# EAGLE design power_amp (EAGLE 6.5.0)
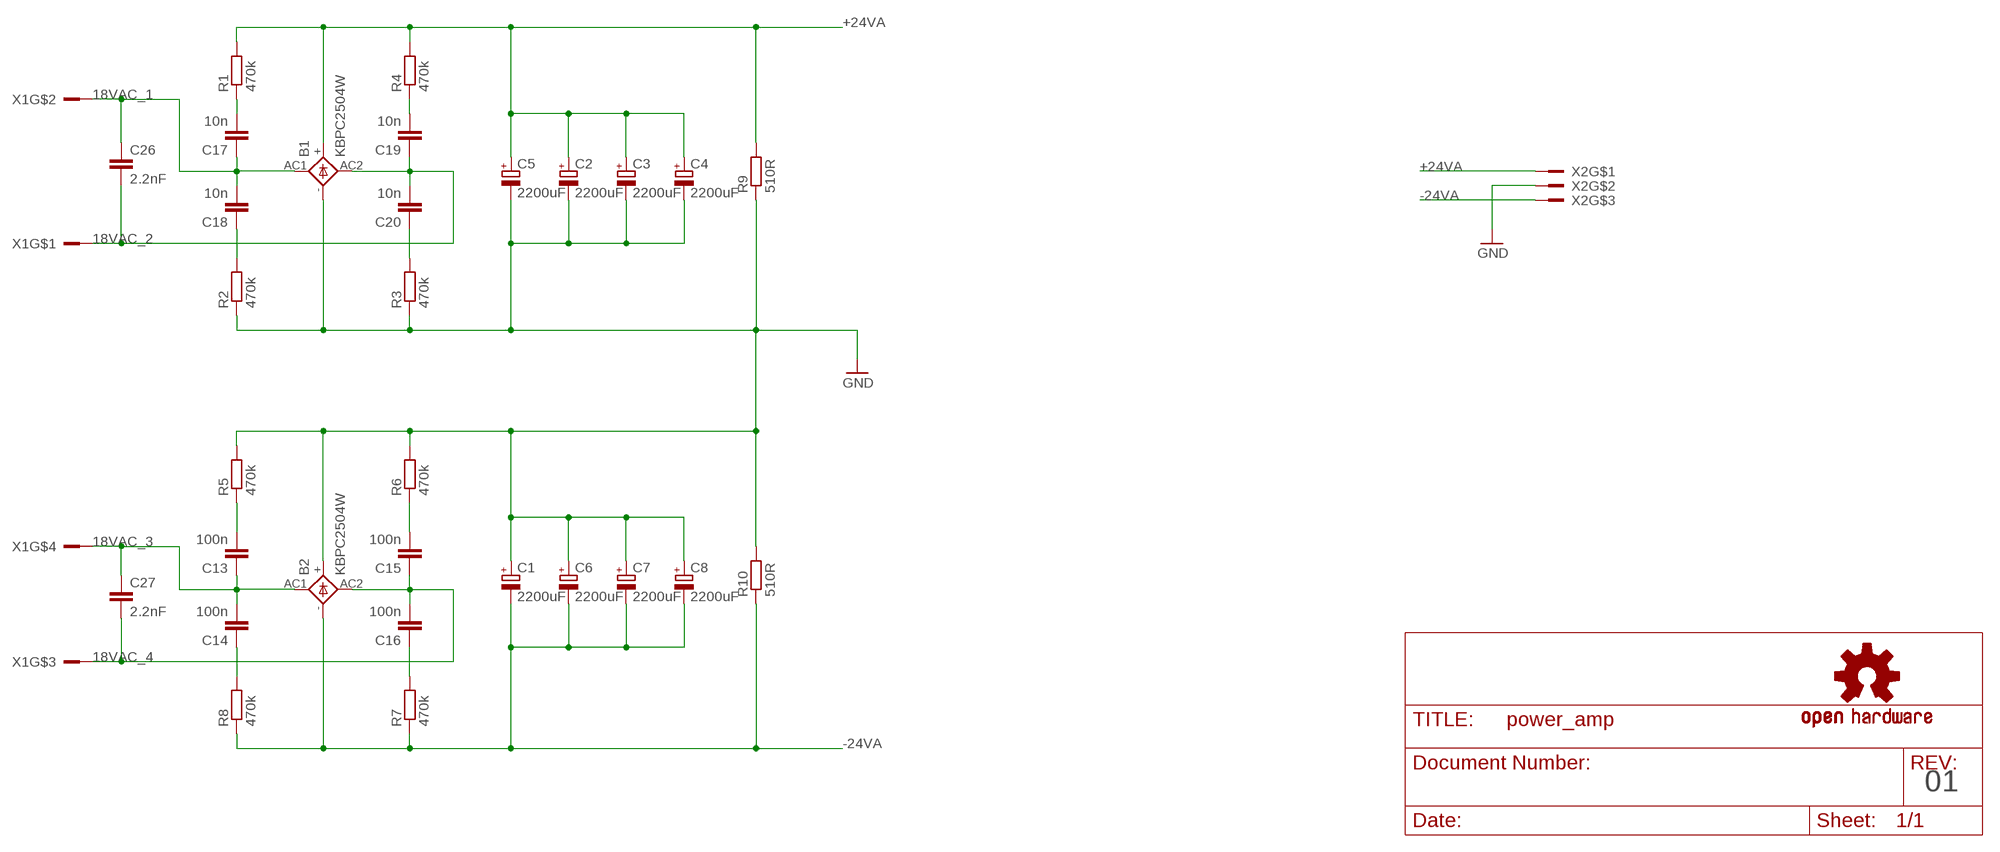
[diagram p0: schematic, sheet 1]

## Parts
B1  KBPC2504W  DC_KBPC  [DC_KBPC]
B2  KBPC2504W  DC_KBPC  [DC_KBPC]
C1  2200uF  CPOL-EUE7.5-18  [E7,5-18]
C2  2200uF  CPOL-EUE7.5-18  [E7,5-18]
C3  2200uF  CPOL-EUE7.5-18  [E7,5-18]
C4  2200uF  CPOL-EUE7.5-18  [E7,5-18]
C5  2200uF  CPOL-EUE7.5-18  [E7,5-18]
C6  2200uF  CPOL-EUE7.5-18  [E7,5-18]
C7  2200uF  CPOL-EUE7.5-18  [E7,5-18]
C8  2200uF  CPOL-EUE7.5-18  [E7,5-18]
C13  100n  C-EUC0805  [C0805]
C14  100n  C-EUC0805  [C0805]
C15  100n  C-EUC0805  [C0805]
C16  100n  C-EUC0805  [C0805]
C17  10n  C-EUC0805  [C0805]
C18  10n  C-EUC0805  [C0805]
C19  10n  C-EUC0805  [C0805]
C20  10n  C-EUC0805  [C0805]
C26  2.2nF  C5/4.5  [C5B4.5]
C27  2.2nF  C5/4.5  [C5B4.5]
R1  470k  R-EU_R0805W  [R0805W]
R2  470k  R-EU_R0805W  [R0805W]
R3  470k  R-EU_R0805W  [R0805W]
R4  470k  R-EU_R0805W  [R0805W]
R5  470k  R-EU_R0805W  [R0805W]
R6  470k  R-EU_R0805W  [R0805W]
R7  470k  R-EU_R0805W  [R0805W]
R8  470k  R-EU_R0805W  [R0805W]
R9  510R  R-EU_0922/22  [0922/22]
R10  510R  R-EU_0922/22  [0922/22]
U$7  OSHW-LOGOM  [OSHW-LOGO-M]
X1  DEGSON_4  [DEGSON_4]
X2  DEGSON_3  [DEGSON_3]

## Nets
18VAC_1: B1.AC1 C17.1 C18.2 C26.1 X1.2
18VAC_2: B1.AC2 C19.1 C20.2 C26.2 X1.1
18VAC_3: B2.AC1 C13.1 C14.2 C27.1 X1.4
18VAC_4: B2.AC2 C15.1 C16.2 C27.2 X1.3
+24VA: B1.+ C2.+ C3.+ C4.+ C5.+ R1.2 R4.2 R9.2 X2.1
-24VA: B2.- C1.- C6.- C7.- C8.- R7.1 R8.1 R10.1 X2.3
GND: B1.- B2.+ C1.+ C2.- C3.- C4.- C5.- C6.+ C7.+ C8.+ R2.1 R3.1 R5.2 R6.2 R9.1 R10.2 X2.2
N$2: C18.1 R2.2
N$6: C13.2 R5.1
N$9: C17.2 R1.1
N$11: C19.2 R4.1
N$12: C20.1 R3.2
N$17: C14.1 R8.2
N$18: C16.1 R7.2
N$19: C15.2 R6.1

## Notes on the sheet
- 01

## Library data of the parts
B1 B2 = Simplex-DiscreteSemi:DC_KBPC: DC KBPC bridge rectifier
C1-C8 = rcl:CPOL-EU: POLARIZED CAPACITOR, European symbol
C13-C20 = rcl:C-EU: CAPACITOR, European symbol
C26 C27 = capacitor-wima:C: CAPACITOR naming: grid - package width
R1-R10 = rcl:R-EU_: RESISTOR, European symbol
U$7 = SparkFun:OSHW-LOGO: Open Source Hardware Logo This logo indicates the piece of hardware it is found on incorporates a OSHW license and/or adheres to the definition of open source hardware found here: http://freedomdefined.org/OSHW
X1 = Simplex-Connectors:DEGSON_4: DEGSON 4 pole screw terminals 10mm grid
X2 = Simplex-Connectors:DEGSON_3

## Net classes
1 vcc: width 0.203 mm

## Board
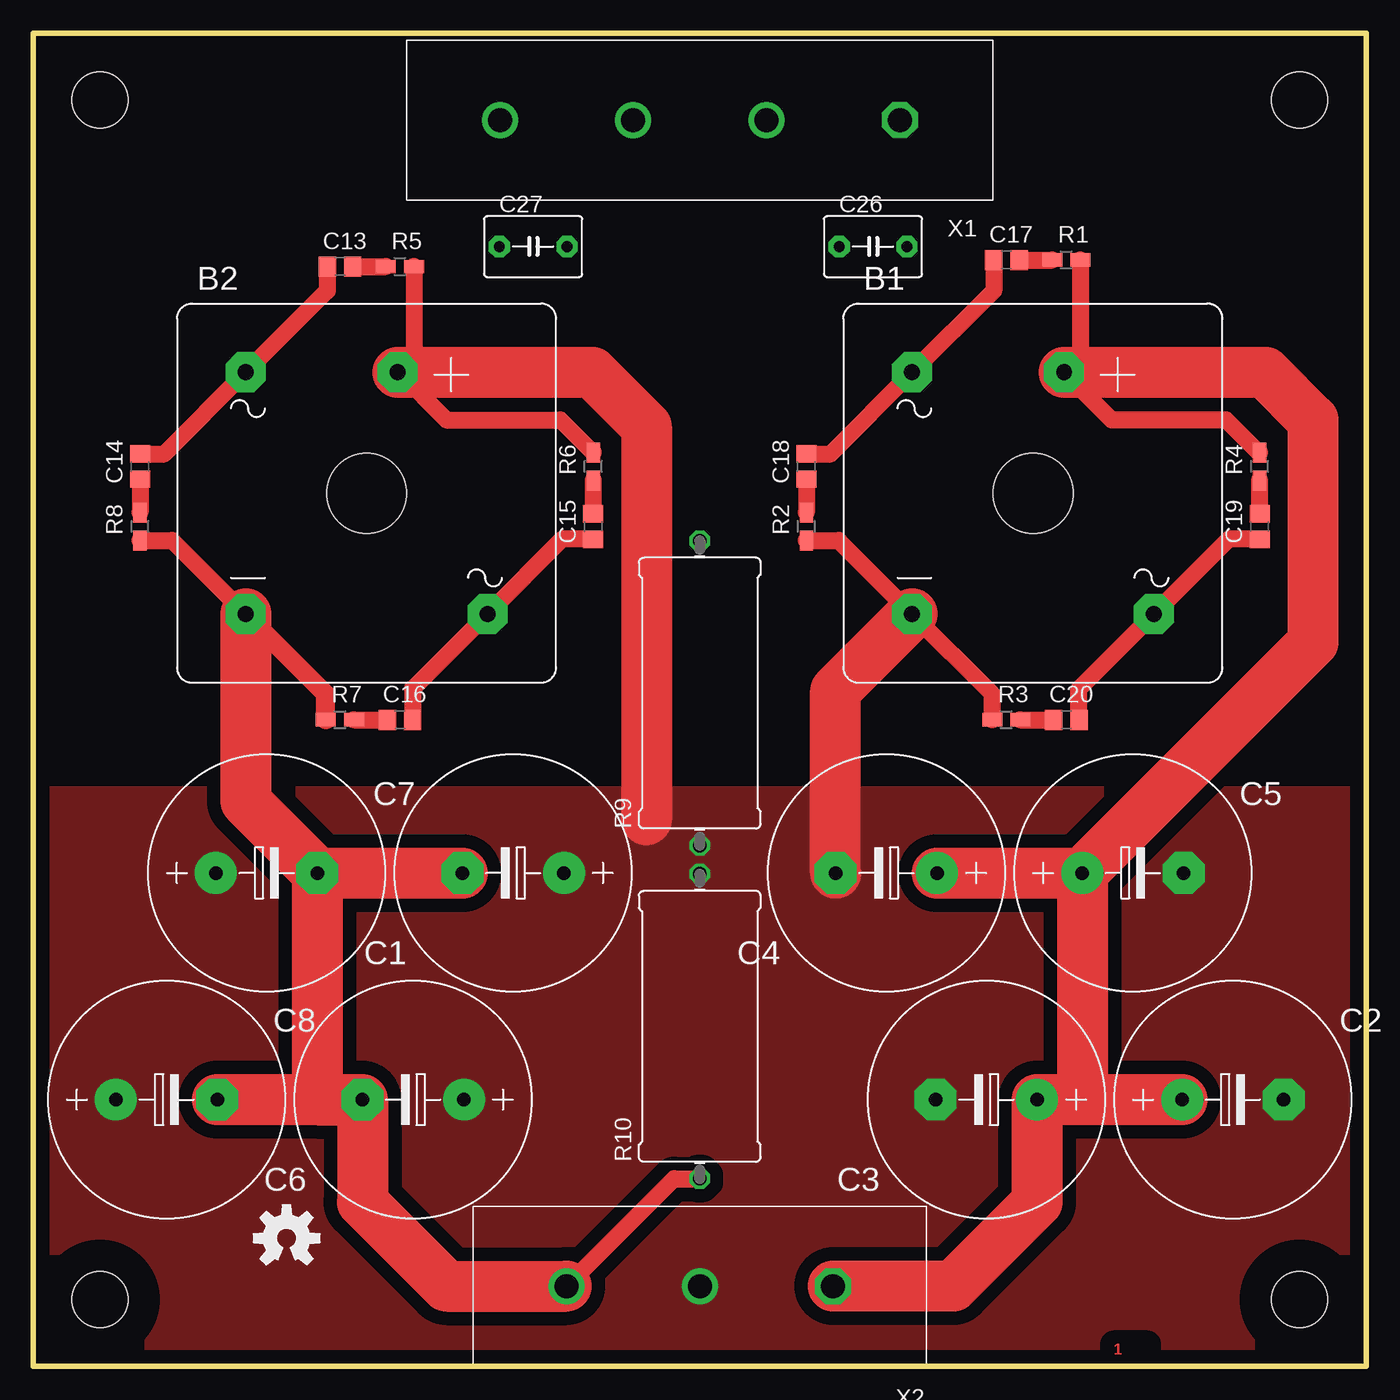
[diagram p1: board, top side]
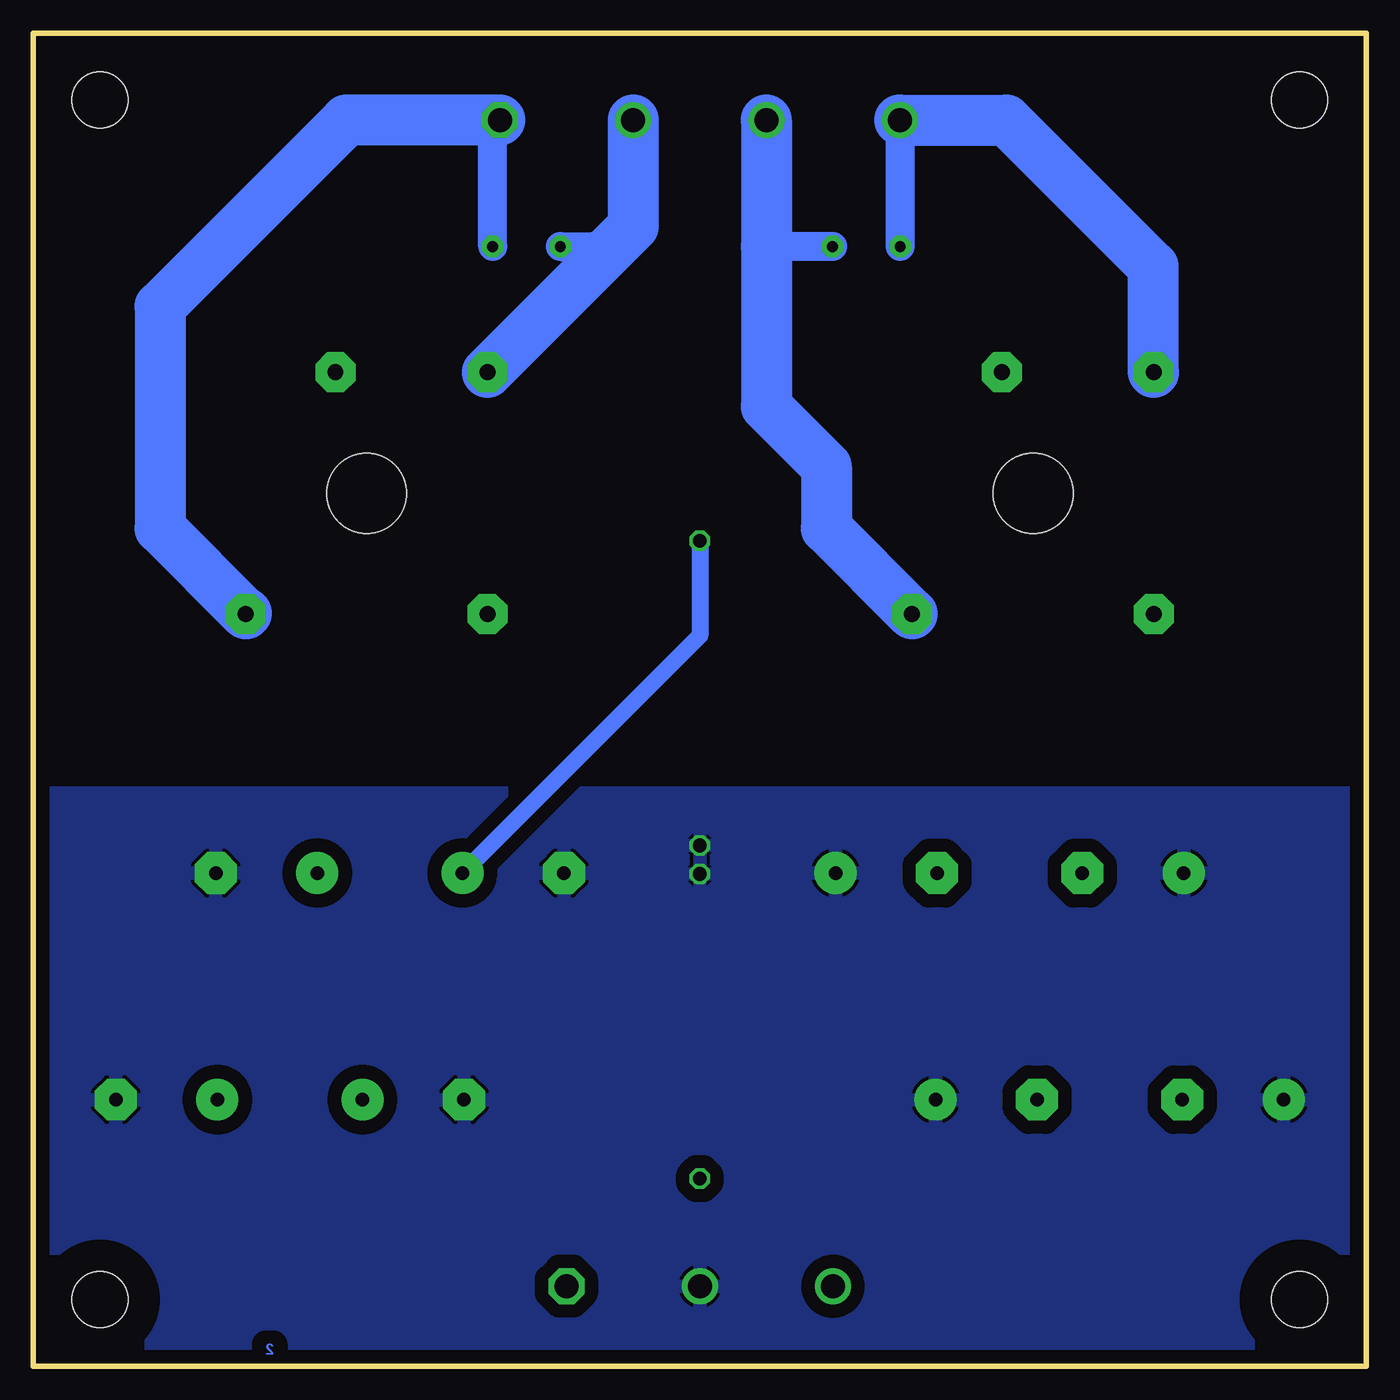
[diagram p2: board, bottom side, seen from below]

Size 100 x 100 mm. Coordinates in mm from the lower left corner, seen from the top.
Outline: 0,0 100,0 100,100 0,100 0,0
Copper layers (1*2*15*16): Top 0.035mm / dielectric 0.2mm / Route2 0.0175mm / dielectric 1.1mm / Route15 0.0175mm / dielectric 0.2mm / Bottom 0.035mm
Design rules "SeeedStudio_DRU_no_angle_20130527": minimum track width 6mil, minimum drill 12mil, track to track 6mil, track to pad 6mil, pad to pad 6mil, via to via 6mil, smd to smd 0mil, copper to edge 10mil, drill to drill 10mil, minimum pad ring 6mil, minimum via ring 6mil, stop-mask expansion 2mil, vias tented up to drill 25mil, thermal gap 10mil
Holes 4.2 mm at 5,95 95,5 5,5 95,95
tRestrict: area 91.7,1.7 to 98.3,8.3; area 91.7,91.7 to 98.3,98.3; area 1.7,1.7 to 8.3,8.3; area 1.7,91.7 to 8.3,98.3
bRestrict: area 1.7,91.7 to 8.3,98.3; area 91.7,91.7 to 98.3,98.3; area 91.7,1.7 to 98.3,8.3; area 1.7,1.7 to 8.3,8.3

### Footprints (pad centres in the part's own frame; a part is rotated, then mirrored left to right if it is on the bottom)
DC_KBPC = drill 1.194 pad 3 octagon: + 2.337,9.068; - -9.068,-9.068; AC1 -9.068,9.068; AC2 9.068,-9.068 | hole 6: 0,0
E7,5-18 = drill 1.016 pad 3.15: + -3.81,0 | drill 1.016 pad 3.15 octagon: - 3.81,0
C0805 = smd 1.3 x 1.5: 1 -0.95,0; 2 0.95,0
C5B4.5 = drill 0.813 pad 1.6 octagon: 1 -2.54,0; 2 2.54,0
R0805W = smd 1.5 x 1: 1 -1.052,0; 2 1.052,0
0922/22 = drill 1.016 octagon: 1 -11.43,0; 2 11.43,0
DEGSON_4 = drill 1.8 octagon: 1 -15,0 | drill 1.8: 2 -5,0; 3 5,0; 4 15,0
DEGSON_3 = drill 1.8 octagon: 1 -10,0 | drill 1.8: 2 0,0; 3 10,0

### Placement (x,y rotation side)
B1  75,65.5 0 top
B2  25,65.5 0 top
C1  36,37 180 top
C2  90,20 0 top
C3  71.5,20 180 top
C4  64,37 180 top
C5  82.5,37 0 top
C6  28.5,20 180 top
C7  17.5,37 0 top
C8  10,20 0 top
C13  23,82.5 0 top
C14  8,67.5 90 top
C15  42,63 90 top
C16  27.5,48.5 0 top
C17  73,83 0 top
C18  58,67.5 90 top
C19  92,63 90 top
C20  77.5,48.5 0 top
C26  63,84 0 top
C27  37.5,84 0 top
R1  77.5,83 0 top
R2  58,63 90 top
R3  73,48.5 0 top
R4  92,67.5 90 top
R5  27.5,82.5 0 top
R6  42,67.5 90 top
R7  23,48.5 0 top
R8  8,63 90 top
R9  50,50.5 90 top
R10  50,25.5 90 top
U$7  19,9.6 0 top
X1  50,93.5 180 top
X2  50,6 180 top

### Tracks (layer width: path | path; a pad name or v marks a point on that pad's centre or on a via)
18VAC_1
  Top 1.27: C18.2 59.81,68.45 B1.AC1 72.05,80.69 C17.1
  Bottom 2.184: C26.1 58,84 57.25,83.25
  Bottom 3.81: X1.2 55,85.5 57.25,83.25 B1.AC1
18VAC_2
  Top 1.27: C19.1 89.69,62.05 B1.AC2 78.45,50.81 C20.2
  Bottom 2.184: C26.2 65.54,92.96 X1.1
  Bottom 3.81: X1.1 76.5,93.5 90.5,79.5 90.5,62.86 B1.AC2 | 84,56.5 B1.AC2 | 86.5,58.86 B1.AC2
18VAC_3
  Top 1.27: C13.1 22.05,80.69 B2.AC1 9.81,68.45 C14.2
  Bottom 2.184: C27.1 34.96,93.46 X1.4
  Bottom 3.81: X1.4 27,93.5 16,82.5 16,74.64 B2.AC1
18VAC_4
  Top 1.27: C15.1 39.69,62.05 B2.AC2 28.45,50.81 C16.2
  Bottom 2.184: C27.2 45,84
  Bottom 3.81: X1.3 45,84 45,72 40.5,67.5 40.5,62.86 B2.AC2
+24VA
  Top 1.27: R1.2 78.55,75.78 B1.+ 80.91,71 89.5,71 91.95,68.55 R4.2
  Top 3.81: C4.+ C5.+ | C5.+ 78.69,20 C3.+ | C2.+ C3.+ | C3.+ 75.31,12.31 69,6 X2.1 | B1.+ 92.43,74.57 96,71 96,54.31 C5.+
  Bottom 1.27: R9.2 50,54.81 C4.+
-24VA
  Top 1.27: X2.3 48.07,14.07 R10.1 | R8.1 10.42,61.95 B2.-
  Top 1.422: R7.1 21.95,50.42 B2.-
  Top 3.81: C7.- C1.- | C6.- C8.- | C7.- 21.31,20 C6.- | C6.- 24.69,12.31 31,6 X2.3 | B2.- 15.93,42.38 C7.-
GND
  Top 1.27: R5.2 28.55,75.78 B2.+ 27.43,74.57 31,71 39.55,71 R6.2 | R2.1 60.42,61.95 B1.- 71.95,50.42 R3.1
  Top 3.81: C4.- 60.19,50.69 B1.- | B2.+ 41.93,74.57 46,70.5 46,41
  pour Top (isolate 1.016, no thermals): 0,43 100,43 100,0 0,0
  pour Bottom (isolate 1.016): 0,43 100,43 100,0 0,0
N$2
  Top 1.27: C18.1 R2.2
N$6
  Top 1.27: C13.2 R5.1
N$9
  Top 1.27: C17.2 R1.1
N$11
  Top 1.27: C19.2 R4.1
N$12
  Top 1.27: R3.2 C20.1
N$17
  Top 1.27: C14.1 R8.2
N$18
  Top 1.27: R7.2 C16.1
N$19
  Top 1.27: R6.1 C15.2

### Text on the board
Top: 1
Bottom: 2
tmine: 2x18VAC | -24VDC GND +24VDC | power circuit for amp rev 1.0 / github.com/rodan/ampy / author: petre rodan / date: apr 2014